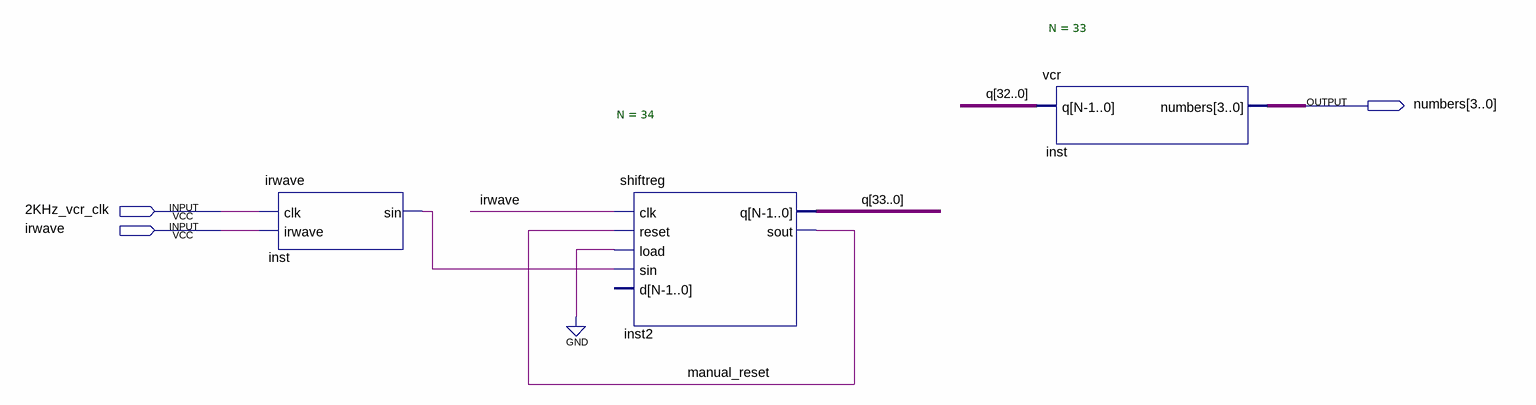
[diagram p0: schematic sheet]
// Quartus schematic vcrdriver.bdf as structural Verilog: 3 symbols, 3 pins
module vcrdriver (
  input  \2KHz_vcr_clk ,
  input  irwave,
  output [3:0] numbers
);

  wire inst_sin, manual_reset;
  wire [33:0] q;

  irwave inst (.clk(\2KHz_vcr_clk ), .irwave(irwave), .sin(inst_sin));
  shiftreg #(.N(34)) inst2 (
    .clk(irwave), .reset(manual_reset), .load(1'b0), .sin(inst_sin), .q(q), .sout(manual_reset));  // open: d
  vcr #(.N(33)) inst_dup2 (.q(q[32:0]), .numbers(numbers));
endmodule
